# Altium schematic sheet SHDN-CURRENT-S10-V00-5kWAlarm.SchDoc: 5kW Alarm
size A3; DrawnBy: Jonn Dillon; DocumentNumber: 10; SheetNumber: 10; SheetTotal: 14; Project: Shutdown Current Board 2020
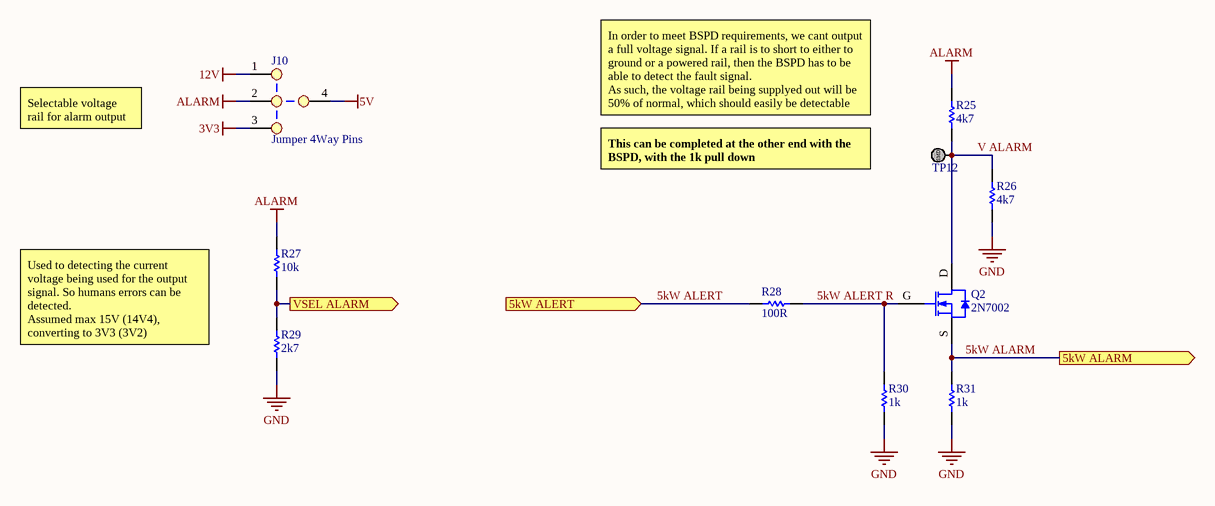
[diagram p0: SHDN-CURRENT-S10-V00-5kWAlarm.SchDoc]

## Parts
J10  Jumper 4Way Pins  [Jumper_4Way_Pin]
Q2  2N7002  [SOT23-3]
R25  4k7  [Res_ThinFilm_0603]
R26  4k7  [Res_ThinFilm_0603]
R27  10k  [Res_ThinFilm_0603]
R28  100R  [Res_ThinFilm_0603]
R29  2k7  [Res_ThinFilm_0603]
R30  1k  [Res_ThinFilm_0603]
R31  1k  [Res_ThinFilm_0603]
TP12  TestPoint_SMD  [TestPointSMD]  (value not drawn)

## Ports
5kW ALARM (out), 5kW ALERT (in), VSEL ALARM (out)

## Nets
3V3: J10.3
5V: J10.4
12V: J10.1
ALARM: J10.2 R25.2 R27.2
GND: R26.1 R29.1 R30.1 R31.1
5kW ALARM: Q2.S R31.2 ; port 5kW ALARM
5kW ALERT: R28.1 ; port 5kW ALERT
5kW ALERT R: Q2.G R28.2 R30.2
V ALARM: Q2.D R25.1 R26.2 TP12.1
VSEL ALARM: R27.1 R29.2 ; port VSEL ALARM

## Notes on the sheet
- In order to meet BSPD requirements, we cant output a full voltage signal. If a rail is to short to either to ground or a powered rail, then the BSPD has to be able to detect the fault signal.
  As such, the voltage rail being supplyed out will be 50% of normal, which should easily be detectable
- Selectable voltage rail for alarm output
- This can be completed at the other end with the BSPD, with the 1k pull down
- Used to detecting the current voltage being used for the output signal. So humans errors can be detected.
  Assumed max 15V (14V4), converting to 3V3 (3V2)
- Revision History:
- Sheet Title:
- Rev
- Date
- Description
- Project:
- Size:
- Drawn By:
- A3
- Number:
- Revision:
- Sheet
- Version:
- of
- QUT Motorsport
- O-120, Gardens Point
- 2 George Street
- Brisbane, QLD 4000
- Australia
- Print Date:
- Print Time:
- File Name:
- (in symbol TestPoint_SMD) SMD

## Library data of the parts
R25 R26 = 4k7 5% 0603: Resistor, SMD, 4k7, 0.1W, 5%, 0603
R27 = 10k 5% 0603: Resistor, SMD, 10k, 0.1W, 5%, 0603
R28 = 100R 5%, 0603: Resistor, SMD, 100R, 0.1W, 5%, 0603
R29 = 2k7 5% 0603: Resistor, SMD, 2k7, 0.1W, 5%, 0603
R30 R31 = 1k 5% 0603: Resistor, SMD, 1k, 0.1W, 5%, 0603